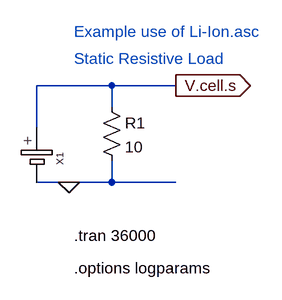
[diagram p0: schematic Resistive-Load-Example.asc]
Resistive-Load-Example.asc, the LTspice schematic file:
Version 4.1
SHEET 1 1476 680
WIRE 144 96 32 96
WIRE 240 96 144 96
WIRE 144 128 144 96
WIRE 32 160 32 96
WIRE 80 240 32 240
WIRE 144 240 144 208
WIRE 144 240 80 240
WIRE 240 240 144 240
FLAG 80 240 0
FLAG 240 96 V.cell.s
IOPIN 240 96 Out
SYMBOL res 128 112 R0
SYMATTR InstName R1
SYMATTR Value 10
SYMBOL Li-Ion -96 208 R0
SYMATTR InstName X1
SYMATTR Description Lithium-In Battery
TEXT 88 56 Left 2 ;Static Resistive Load
TEXT 88 368 Left 2 !.options logparams
TEXT 88 320 Left 2 !.tran 36000
TEXT 88 16 Left 2 ;Example use of Li-Ion.asc

The netlist it stands for:
* Resistive-Load-Example.asc
R1 V.cell.s 0 10
X§X1 V.cell.s 0 Li-Ion  ; pins cell+ cell-
* Static Resistive Load
.options logparams
.tran 36000
* Example use of Li-Ion.asc
.backanno
.end